# EAGLE design breakout (EAGLE 5.07)
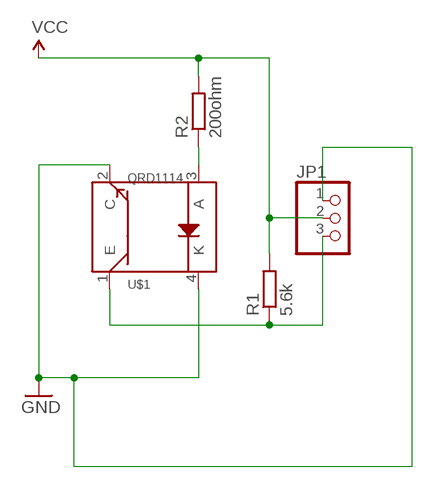
[diagram p0: schematic, sheet 1]

## Parts
JP1  PINHD-1X3  [1X03]
R1  5.6k  R-EU_0204/7  [0204/7]
R2  200ohm  R-EU_0204/7  [0204/7]
U$1  QRD1114  [QRD1114]

## Nets
GND: JP1.1 U$1.2(C) U$1.4(K)
N$1: R2.1 U$1.3(A)
N$2: JP1.3 R1.1 U$1.1(E)
VCC: JP1.2 R1.2 R2.2

## Library data of the parts
JP1 = adafruit:PINHD-1X3: PIN HEADER
R1 R2 = resistor:R-EU_: RESISTOR, European symbol
U$1 = SparkFun:QRD1114

## Board
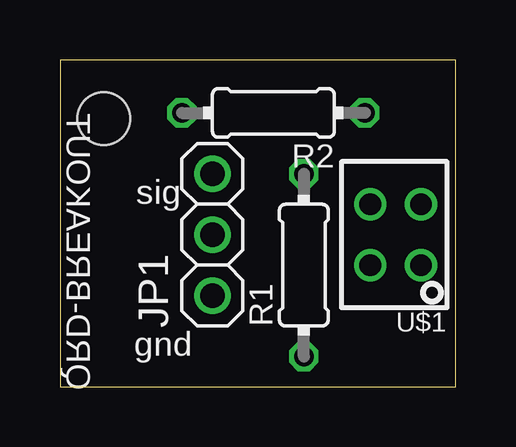
[diagram p1: board, top side]
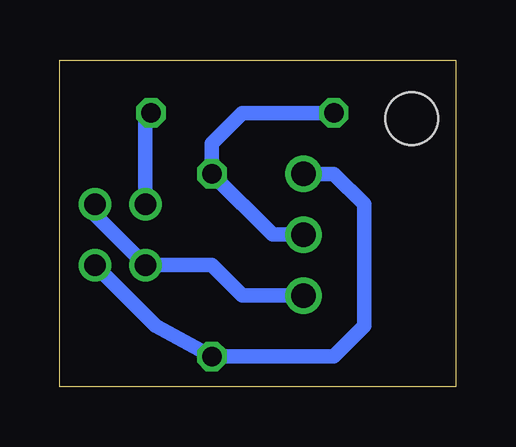
[diagram p2: board, bottom side, seen from below]

Size 16.49 x 13.64 mm. Coordinates in mm from the lower left corner, seen from the top.
Outline: 0,0 16.49,0 16.49,13.64 0,13.64 0,0
Copper layers (1*16): Top 0.0356mm / dielectric 1.5011mm / Bottom 0.0356mm
Design rules "LaenPCBOrder": minimum track width 6mil, minimum drill 13mil, track to track 6mil, track to pad 6mil, pad to pad 6mil, via to via 6mil, smd to smd 6mil, copper to edge 15mil, drill to drill 6mil, minimum pad ring 7mil, minimum via ring 7mil, stop-mask expansion 4mil, vias tented up to drill 0mil, thermal gap 10mil
Holes 2.2 mm at 1.83,11.2

### Footprints (pad centres in the part's own frame; a part is rotated, then mirrored left to right if it is on the bottom)
1X03 = drill 1.016 round: 1 -2.54,0; 2 0,0; 3 2.54,0
0204/7 = drill 0.813 octagon: 1 -3.81,0; 2 3.81,0
QRD1114 = drill 0.9 round: 1 -1.067,1.27; 2 -1.067,-1.27; 3 1.041,-1.27; 4 1.041,1.27

### Placement (x,y rotation side)
JP1  6.35,6.35 90 top
R1  10.16,5.08 90 top
R2  8.89,11.43 180 top
U$1  13.97,6.35 180 top

### Tracks (layer width: path | path; a pad name or v marks a point on that pad's centre or on a via)
GND
  Bottom 0.61: U$1.2 15.04,7.19 U$1.4 10.16,5.08 8.89,3.81 JP1.1
N$1
  Bottom 0.61: U$1.3 12.93,11.66 R2.1
N$2
  Bottom 0.61: U$1.1 12.5,2.54 R1.1 5.08,1.27 3.81,2.54 3.81,7.62 5.08,8.89 JP1.3
VCC
  Bottom 0.61: JP1.2 7.62,6.35 R1.2 10.16,10.16 8.89,11.43 R2.2

### Text on the board
tPlace: sig | gnd
tNames: QRD-BREAKOUT